# EAGLE design cardspoofer (EAGLE 6.3)
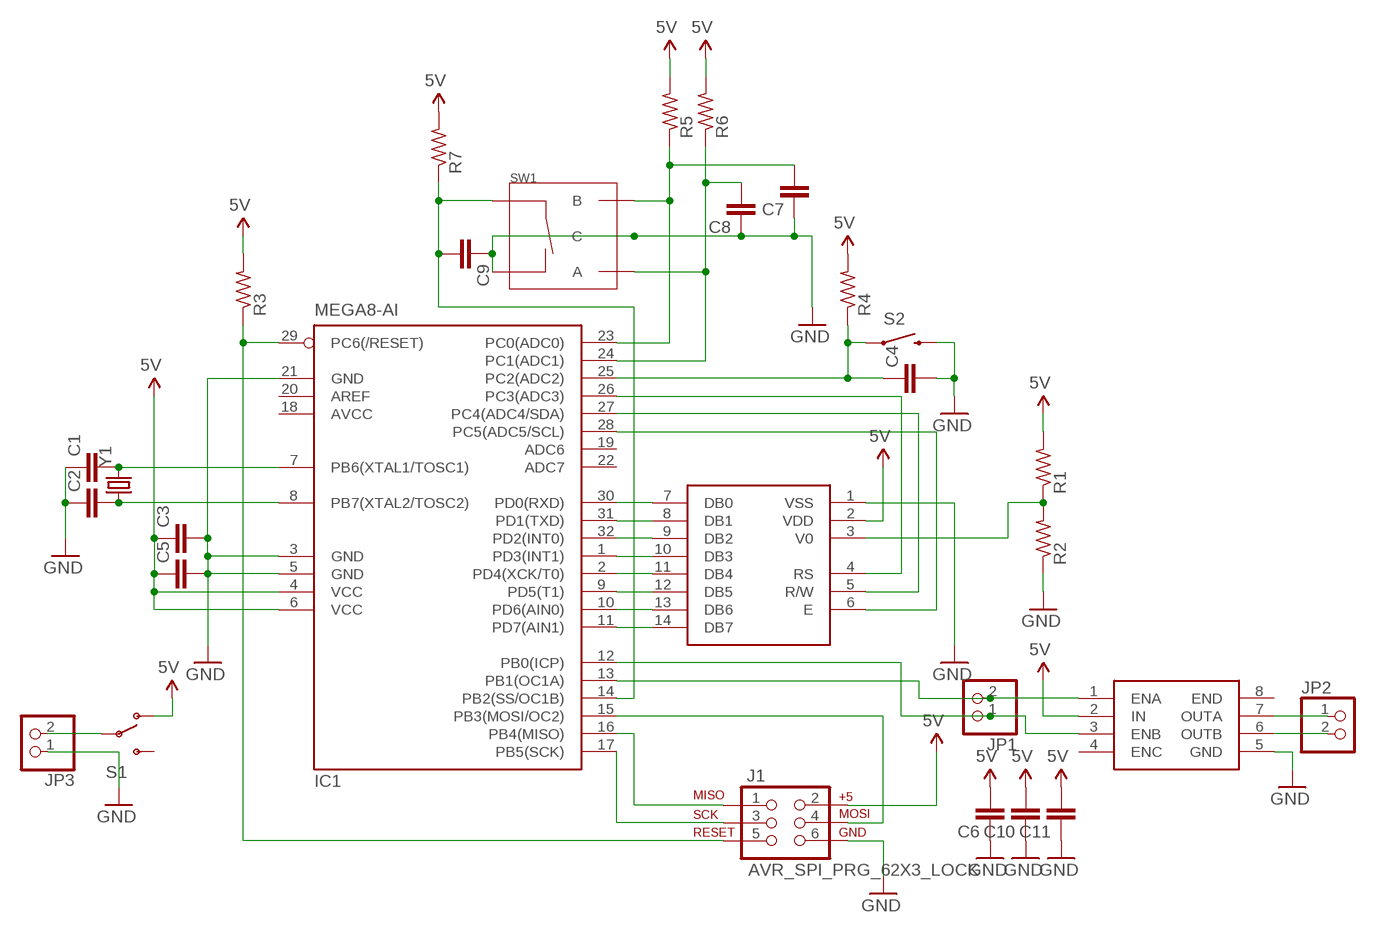
[diagram p0: schematic, sheet 1]

## Parts
C1  C-EUC0805K  [C0805K]
C2  C-EUC0805K  [C0805K]
C3  C-EUC0805K  [C0805K]
C4  C-EUC0805K  [C0805K]
C5  C-EUC0805K  [C0805K]
C6  C-EUC0805K  [C0805K]
C7  C-EUC0805K  [C0805K]
C8  C-EUC0805K  [C0805K]
C9  C-EUC0805K  [C0805K]
C10  C-EUC0805K  [C0805K]
C11  C-EUC0805K  [C0805K]
IC1  MEGA8-AI  [TQFP32-08]
J1  AVR_SPI_PRG_62X3_LOCK  [2X3_LOCK]
JP1  PINHD-1X2  [1X02]
JP2  PINHD-1X2  [1X02]
JP3  PINHD-1X2  [1X02]
R1  R-US_R0805  [R0805]
R2  R-US_R0805  [R0805]
R3  R-US_R0805  [R0805]
R4  R-US_R0805  [R0805]
R5  R-US_R0805  [R0805]
R6  R-US_R0805  [R0805]
R7  R-US_R0805  [R0805]
S1  SWITCH-SPDTSMD  [AYZ0202]
S2  SWITCH-MOMENTARY-2-SMD-1101NE  [TACTILE-SWITCH-1101NE]
SW1  ROTARTY_ENCODER  [ROTARY_ENC_PLAIN]
U$1  LCD  [NHD-0208AZ-RN-YBW-ND]
U$2  HBRIDGE  [H-BRIDGE]
Y1  CRYSTAL5X3  [CRYSTAL-SMD-5X3]

## Nets
5V: C3.1 C5.1 C6.2 C10.2 C11.2 IC1.4(VCC) IC1.6(VCC) J1.2 R1.2 R3.2 R4.2 R5.2 R6.2 R7.2 S1.1(O) U$1.2(VDD) U$2.2(IN)
GND: C1.1 C2.1 C3.2 C4.2 C5.2 C6.1 C7.1 C8.1 C9.1 C10.1 C11.1 IC1.3(GND) IC1.5(GND) IC1.21(GND) J1.6 JP3.1 R2.1 S2.2 SW1.C SW1.SW- U$1.1(VSS) U$2.5(GND)
N$1: R1.1 R2.2 U$1.3(V0)
N$2: IC1.30(PD0(RXD)) U$1.7(DB0)
N$3: IC1.31(PD1(TXD)) U$1.8(DB1)
N$4: IC1.32(PD2(INT0)) U$1.9(DB2)
N$5: IC1.1(PD3(INT1)) U$1.10(DB3)
N$6: IC1.2(PD4(XCK/T0)) U$1.11(DB4)
N$7: IC1.9(PD5(T1)) U$1.12(DB5)
N$8: IC1.10(PD6(AIN0)) U$1.13(DB6)
N$9: IC1.11(PD7(AIN1)) U$1.14(DB7)
N$10: IC1.26(PC3(ADC3)) U$1.4(RS)
N$11: IC1.27(PC4(ADC4/SDA)) U$1.5(R/W)
N$12: IC1.28(PC5(ADC5/SCL)) U$1.6(E)
N$13: IC1.29(PC6(/RESET)) J1.5 R3.1
N$14: IC1.17(PB5(SCK)) J1.3
N$15: IC1.16(PB4(MISO)) J1.1
N$16: IC1.15(PB3(MOSI/OC2)) J1.4
N$17: C1.2 IC1.7(PB6(XTAL1/TOSC1)) Y1.3
N$18: C2.2 IC1.8(PB7(XTAL2/TOSC2)) Y1.1
N$19: C4.1 IC1.25(PC2(ADC2)) R4.1 S2.1
N$20: IC1.13(PB1(OC1A)) JP1.2 U$2.1(ENA)
N$21: IC1.12(PB0(ICP)) JP1.1 U$2.3(ENB)
N$22: JP2.1 U$2.7(OUTA)
N$23: JP2.2 U$2.6(OUTB)
N$24: C7.2 IC1.23(PC0(ADC0)) R5.1 SW1.B
N$25: C8.2 IC1.24(PC1(ADC1)) R6.1 SW1.A
N$26: C9.2 IC1.14(PB2(SS/OC1B)) R7.1 SW1.SW+
N$27: JP3.2 S1.2(P)
Unconnected: IC1.19(ADC6) IC1.20(AREF) IC1.22(ADC7) S1.3(S) U$2.4(ENC) U$2.8(END)

## Power pins joined to a net without a drawn wire
AVCC: IC1.18(AVCC)

## Library data of the parts
C1-C11 = resistor:C-EU: CAPACITOR, European symbol
IC1 = atmel:MEGA8: MICROCONTROLLER 8 Kbytes FLASH, 1 kbytes SRAM, 512 bytes EEPROM, USART, 6-channel 10 bit ADC, 2-channel 8 bit ADC Pin compatible with Atmega48, ATMega88, ATMega168 Source: avr.lbr; MPN: ATMEGA8-16AU; OC_FARNELL: 9171371; OC_NEWARK: 73M8863
J1 = SparkFun-Connectors:AVR_SPI_PRG_6: AVR ISP 6 Pin This is the reduced ISP connector for AVR programming. Common on Arduino. This footprint will take up less PCB space and can be used with a 10-pin to 6-pin adapter such as SKU: BOB-08508 **Special note about "TEST_POINT" package. The stop mask is on the top side, so if you want your programming test points to be on the bottom of your board, make sure to place this package on the bottom side of the board. This also ensure that the orientation to program from the bottom side will be correct.
JP1-JP3 = pinhead:PINHD-1X2: PIN HEADER
R1-R7 = rcl:R-US_: RESISTOR, American symbol
S1 = SparkFun-Electromechanical:SWITCH-SPDT: SPDT Switch Simple slide switch, Spark Fun Electronics SKU : COM-00102 DPDT SMT slide switch, AYZ0202, SWCH-08179; PROD_ID: SWCH-08179
S2 = SparkFun-Electromechanical:SWITCH-MOMENTARY-2: Various NO switches- pushbuttons, reed, etc
SW1 = SparkFun-Electromechanical:ROTARTY_ENCODER: Simple no LED rotary encoder Example: COM-09117
U$1 = lcd:LCD
U$2 = hbridgedriver:HBRIDGE: AAT4901
Y1 = SparkFun-FreqCtrl:CRYSTAL: Various standard crystals. Proven footprints. Spark Fun Electronics SKU : COM-00534

## Board
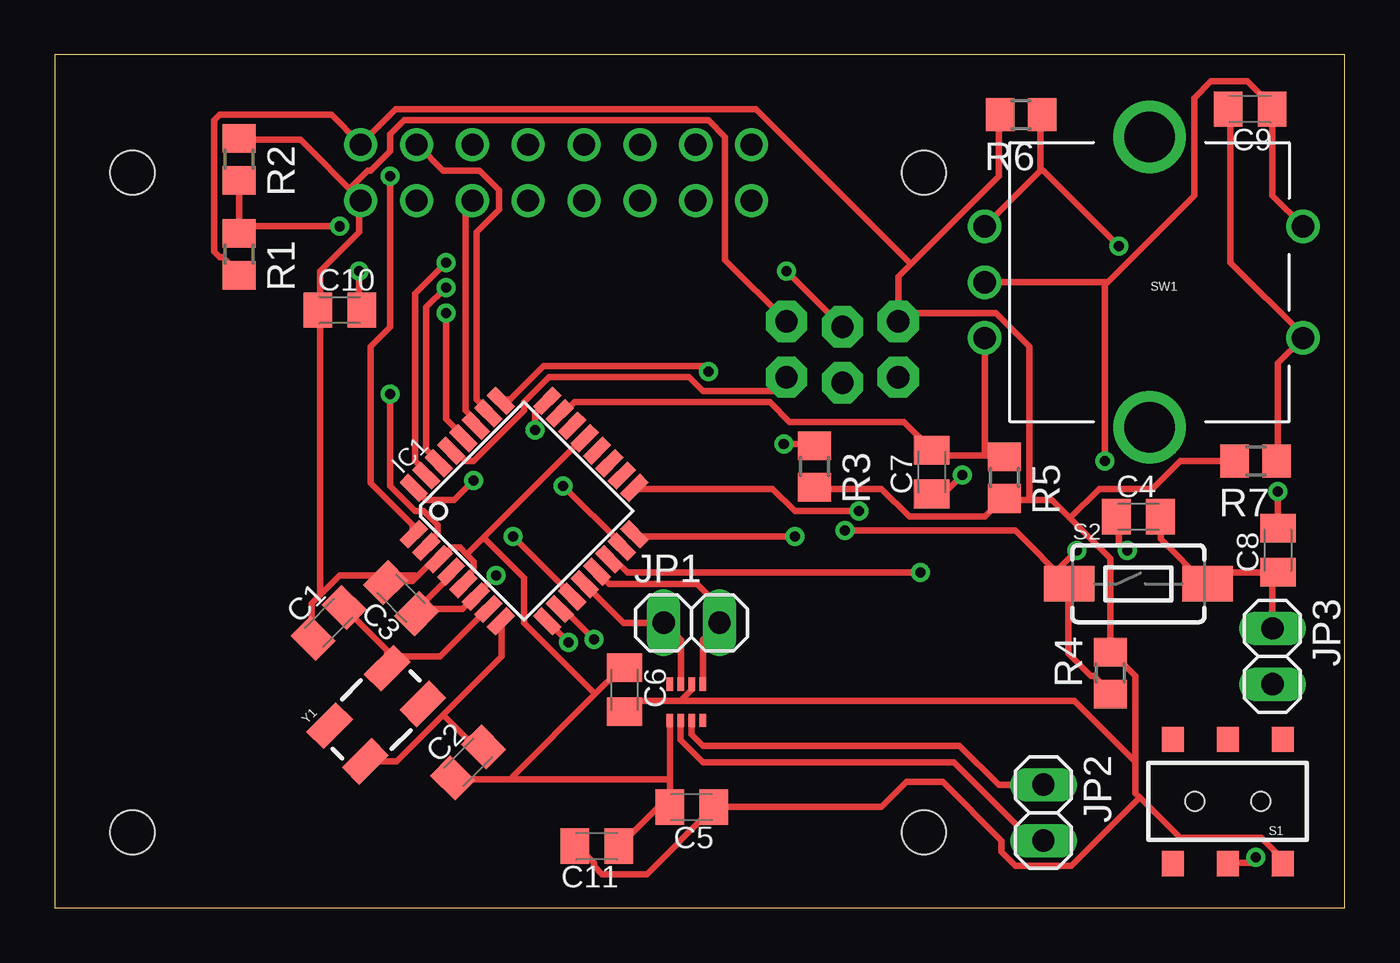
[diagram p1: board, top side]
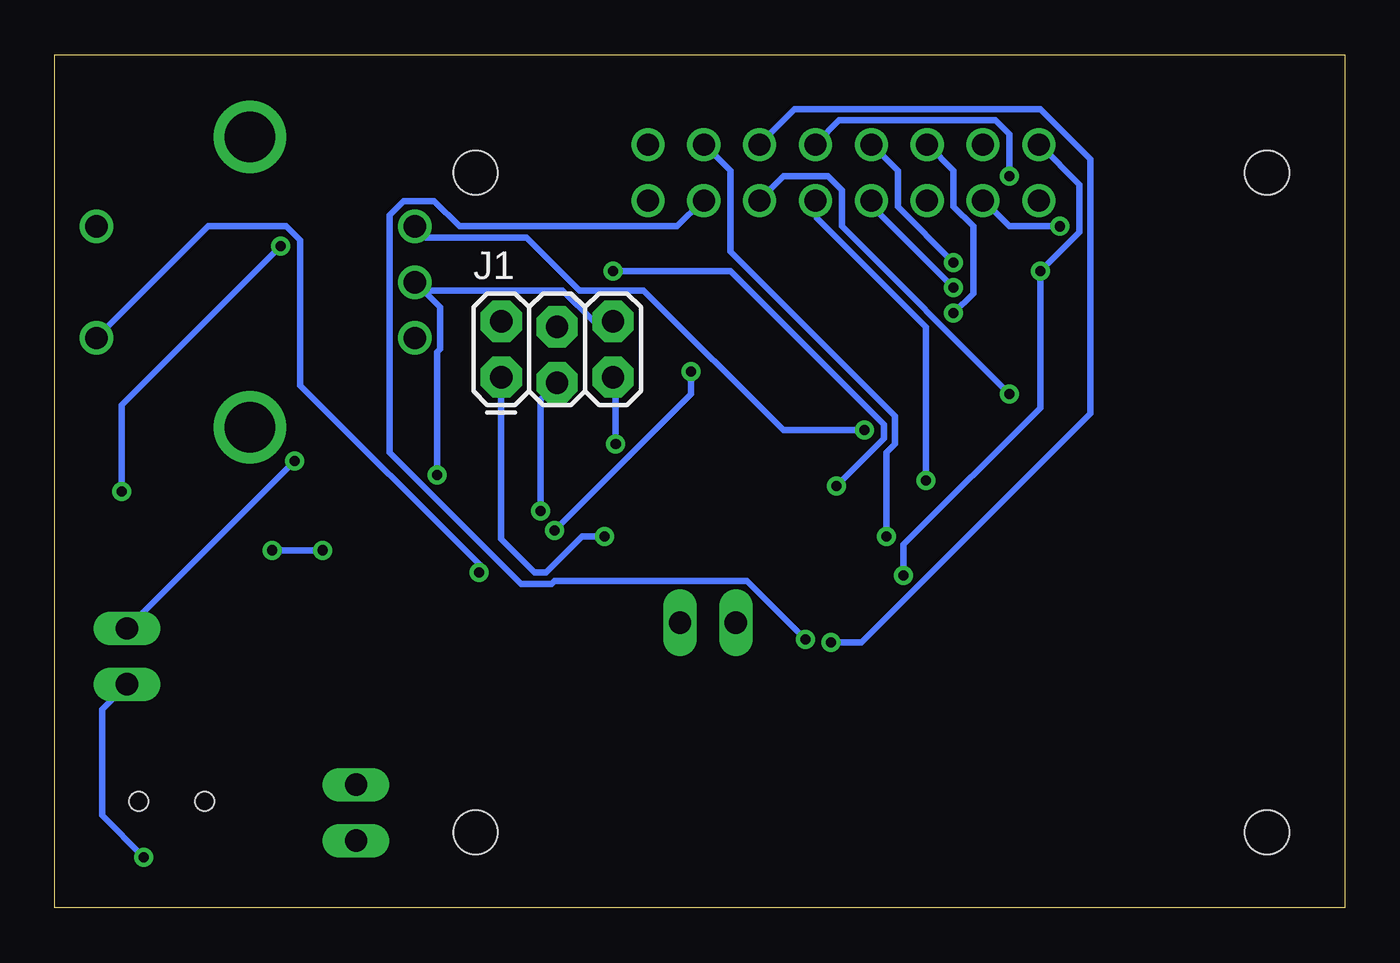
[diagram p2: board, bottom side, seen from below]

Size 58.65 x 38.79 mm. Coordinates in mm from the lower left corner, seen from the top.
Outline: 0,0 58.65,0 58.65,38.79 0,38.79 0,0
Copper layers (1*16): Top 0.035mm / dielectric 1.5mm / Bottom 0.035mm
Design rules "default *": minimum track width 12mil, minimum drill 18mil, track to track 8mil, track to pad 8mil, pad to pad 8mil, via to via 8mil, smd to smd 8mil, copper to edge 40mil, drill to drill 8mil, minimum pad ring 10mil, minimum via ring 8mil, stop-mask expansion 4mil, vias tented up to drill 0mil, thermal gap 10mil

### Footprints (pad centres in the part's own frame; a part is rotated, then mirrored left to right if it is on the bottom)
C0805K = smd 1.3 x 1.6: 1 -1,0; 2 1,0
TQFP32-08 = smd 1.27 x 0.559: 1 -4.293,2.8; 2 -4.293,2; 3 -4.293,1.2; 4 -4.293,0.4; 5 -4.293,-0.4; 6 -4.293,-1.2; 7 -4.293,-2; 8 -4.293,-2.8; 17 4.293,-2.8; 18 4.293,-2; 19 4.293,-1.2; 20 4.293,-0.4; 21 4.293,0.4; 22 4.293,1.2; 23 4.293,2; 24 4.293,2.8 | smd 0.559 x 1.27: 9 -2.8,-4.293; 10 -2,-4.293; 11 -1.2,-4.293; 12 -0.4,-4.293; 13 0.4,-4.293; 14 1.2,-4.293; 15 2,-4.293; 16 2.8,-4.293; 25 2.8,4.293; 26 2,4.293; 27 1.2,4.293; 28 0.4,4.293; 29 -0.4,4.293; 30 -1.2,4.293; 31 -2,4.293; 32 -2.8,4.293
2X3_LOCK = drill 1.016 pad 1.88 octagon: 1 0,0; 2 0,2.54; 3 2.54,-0.254; 4 2.54,2.286; 5 5.08,0; 6 5.08,2.54
1X02 = drill 1.016 long: 1 -1.27,0; 2 1.27,0
R0805 = smd 1.3 x 1.5: 1 -0.95,0; 2 0.95,0
AYZ0202 = smd 1 x 1.15: 1 -2.5,2.825; 2 0,2.825; 3 2.5,2.825; 4 -2.5,-2.825; 5 0,-2.825; 6 2.5,-2.825 | hole 0.85: 1.5,0; -1.5,0
TACTILE-SWITCH-1101NE = smd 2.3 x 1.6: 1 -3.15,0; 2 3.15,0
ROTARY_ENC_PLAIN = drill 1.016: A 7.493,-2.54; B 7.493,2.54; C 7.493,0; SW+ -6.985,2.54; SW- -6.985,-2.54 | drill 2.286: P$3 0,6.604; P$4 0,-6.604
NHD-0208AZ-RN-YBW-ND = drill 1: 1 12.38,-4.67; 2 12.38,-2.13; 3 14.92,-4.67; 4 14.92,-2.13; 5 17.46,-4.67; 6 17.46,-2.13; 7 20,-4.67; 8 20,-2.13; 9 22.54,-4.67; 10 22.54,-2.13; 11 25.08,-4.67; 12 25.08,-2.13; 13 27.62,-4.67; 14 27.62,-2.13; 15 30.16,-4.67; 16 30.16,-2.13 | hole 2: 2,-3.4; 38,-3.4; 2,-33.4; 38,-33.4
H-BRIDGE = smd 0.6 x 0.3: 1 0,0; 2 0,-0.5; 3 0,-1; 4 0,-1.5; 5 1.65,-1.5; 6 1.65,-1; 7 1.65,-0.5; 8 1.65,0
CRYSTAL-SMD-5X3 = smd 1.9 x 1.1: 1 -1.85,-1.15; 2 1.85,-1.15; 3 1.85,1.15; 4 -1.85,1.15

### Placement (x,y rotation side)
C1  12.45,12.95 45 top
C2  18.8,6.6 45 top
C3  15.75,14.08 135 top
C4  49.28,17.78 0 top
C5  28.96,4.57 180 top
C6  25.91,9.91 270 top
C7  39.88,19.81 90 top
C8  55.63,16.26 90 top
C9  54.36,36.32 180 top
C10  12.95,27.18 0 top
C11  24.64,2.79 180 top
IC1  21.34,18.03 45 top
J1  38.35,24.13 0 bottom
JP1  28.96,12.95 0 top
JP2  44.96,4.32 270 top
JP3  55.37,11.43 270 top
R1  8.38,29.72 270 top
R2  8.38,34.04 270 top
R3  34.54,20.07 270 top
R4  48.01,10.67 90 top
R5  43.18,19.56 270 top
R6  43.94,36.07 180 top
R7  54.61,20.32 180 top
S1  53.34,4.83 180 top
S2  49.28,14.73 0 top
SW1  49.78,28.45 180 top
U$1  1.52,36.83 0 top
U$2  29.46,10.16 270 top
Y1  14.61,8.77 45 top

### Tracks (layer width: path | path; a pad name or v marks a point on that pad's centre or on a via)
5V  (via drill 0.46)
  Top 0.305: U$2.2 28.96,9.91 28.45,9.4 | 28.45,9.4 26.4,9.4 C6.2 | IC1.4 17.91,15.24 17.91,14.99 16.38,13.46 C3.1 16.64,13.59 18.54,13.59 19.05,14.1 IC1.6 19.18,14.22 v20.07,15.11 | R1.2 8.38,28.83 7.62,29.59 7.49,29.59 7.24,29.84 7.24,35.81 7.49,36.07 12.57,36.07 13.84,34.8 U$1.2 13.97,34.8 15.49,36.32 31.88,36.32 38.93,29.27 | v13.84,28.96 13.84,27.18 C10.2 | 38.93,29.27 38.35,28.7 J1.2 38.48,27.05 42.8,27.05 44.32,25.53 44.32,18.54 | 38.93,29.27 42.93,33.27 42.93,36.07 R6.2 | C11.2 23.75,2.79 24.51,2.03 24.51,1.91 24.89,1.52 26.92,1.52 29.97,4.57 C5.1 37.59,4.57 38.73,5.71 40.39,5.71 43.05,3.05 43.05,2.54 43.69,1.91 46.23,1.91 49.34,5.02 | 49.34,5.02 49.15,5.21 49.15,6.73 | 49.34,5.02 51.18,3.17 54.86,3.17 55.75,2.29 55.75,2.03 S1.1 | 49.15,6.73 49.15,10.54 48.01,11.68 R4.2 48.01,15.88 46.16,17.72 | 44.32,18.54 45.34,18.54 46.16,17.72 | 44.32,18.54 43.18,18.54 R5.2 43.05,18.54 42.29,17.78 38.86,17.78 37.59,19.05 34.54,19.05 R3.2 | R7.2 51.18,20.32 49.91,19.05 47.5,19.05 46.16,17.72 | 28.45,9.4 46.35,9.4 49.02,6.73 49.15,6.73
  Bottom 0.305: U$1.2 13.84,34.67 12.06,32.89 12.06,30.73 v13.84,28.96 13.84,22.73 20.07,16.51 v20.07,15.11
GND  (via drill 0.46)
  Top 0.305: U$2.5 27.96,5.84 | 27.96,5.84 C5.2 27.81,4.95 25.65,2.79 C11.1 | 27.96,5.84 20.83,5.84 | 20.83,5.84 18.16,5.84 C2.1 | 24.57,9.72 20.83,5.97 20.83,5.84 | 24.57,9.72 25.65,10.79 25.91,10.79 C6.1 | R2.1 8.38,34.92 11.18,34.92 13.84,32.26 U$1.1 | U$1.1 13.84,32.13 13.84,30.73 12.06,28.96 12.06,27.18 C10.1 12.06,27.05 12.06,14.35 12.13,14.29 | 16.45,15.05 16.26,14.86 15.11,14.86 C3.2 | 16.45,15.05 17.14,15.75 17.4,15.75 IC1.3 17.53,15.88 18.03,16.38 18.42,16.38 18.73,16.07 | 18.73,16.07 19.05,15.75 19.05,15.37 18.67,14.99 18.67,14.73 IC1.5 | 18.73,16.07 19.5,16.83 | 19.5,16.83 24,21.34 IC1.21 | 12.13,14.29 12.95,15.11 16.38,15.11 16.45,15.05 | 12.13,14.29 11.68,13.84 11.68,12.32 C1.1 | 24.57,9.72 21.34,12.95 21.34,14.99 19.5,16.83 | C4.2 50.29,17.78 50.29,16.76 52.32,14.73 S2.2 51.94,15.24 55.63,15.24 C8.1 55.37,15.11 JP3.1 | SW1.SW- 55.37,32.38 55.37,36.32 C9.1 55.37,36.45 54.23,37.59 52.58,37.59 51.82,36.83 51.82,32.38 47.88,28.45 47.75,28.45 | v41.27,19.68 40.51,18.92 39.88,18.92 C7.1 | SW1.C 47.75,28.45 | 47.75,28.45 v47.75,20.32 | J1.6 30.48,29.46 30.48,35.05 29.72,35.81 15.88,35.81 15.24,35.18 15.24,34.42 14.35,33.53 14.22,33.53 13.46,32.77 U$1.1
  Bottom 0.305: v41.27,19.68 41.27,25.27 41.15,25.4 41.15,27.3 SW1.C 41.78,28.07 35.56,28.07 34.16,26.67 J1.6 | v47.75,20.32 JP3.1
N$1  (via drill 0.46)
  Top 0.305: R2.2 R1.1 8.51,30.99 v12.95,30.99
  Bottom 0.305: v12.95,30.99 15.24,30.99 16.38,32.13 U$1.3
N$2  (via drill 0.46)
  Top 0.305: v17.78,28.19 16.89,27.3 16.89,20.83 17.4,20.32 IC1.30
  Bottom 0.305: v17.78,28.19 21.46,31.88 21.46,32.13 U$1.7
N$3  (via drill 0.46)
  Top 0.305: v17.78,29.34 16.38,27.94 16.38,20.32 16.76,19.94 16.76,19.68 IC1.31
  Bottom 0.305: v17.78,29.34 20.32,31.88 20.32,33.53 21.46,34.67 U$1.8
N$4  (via drill 0.46)
  Top 0.305: v19.05,19.43 18.16,18.54 16.89,18.54 16.38,19.05 IC1.32
  Bottom 0.305: v19.05,19.43 19.05,26.42 24,31.37 24,32.13 U$1.9
N$5  (via drill 0.46)
  Top 0.305: v15.24,33.27 15.24,26.42 14.35,25.53 14.35,19.3 16.26,17.4 16.26,17.02 IC1.1
  Bottom 0.305: v15.24,33.27 15.24,35.18 15.88,35.81 22.99,35.81 24,34.8 U$1.10
N$6  (via drill 0.46)
  Top 0.305: v15.24,23.37 15.24,19.18 16.38,18.03 16.76,18.03 17.4,17.4 17.4,17.02 16.89,16.51 IC1.2
  Bottom 0.305: v15.24,23.37 22.86,30.99 22.86,32.64 23.5,33.27 25.53,33.27 26.54,32.26 U$1.11
N$7  (via drill 0.46)
  Top 0.305: v23.37,12.06 22.48,12.95 IC1.9
  Bottom 0.305: v23.37,12.06 21.97,12.06 11.56,22.48 11.56,34.04 13.84,36.32 25.02,36.32 26.54,34.8 U$1.12
N$8  (via drill 0.46)
  Top 0.305: v24.51,12.19 23.24,13.46 22.99,13.46 IC1.10
  Bottom 0.305: v24.51,12.19 27.18,14.86 35.94,14.86 36.07,14.73 37.46,14.73 43.43,20.7 43.43,31.5 42.8,32.13 41.4,32.13 40.26,30.99 30.35,30.99 29.21,32.13 U$1.13
N$9  (via drill 0.46)
  Top 0.305: v20.83,16.89 23.5,14.22 IC1.11
  Bottom 0.305: v20.83,16.89 20.83,20.7 20.45,21.08 20.45,22.35 27.94,29.84 27.94,33.53 29.08,34.67 U$1.14
N$10
  Top 0.305: IC1.26 19.69,22.61 19.18,23.11 19.18,30.73 20.19,31.75 20.19,32.64 19.3,33.53 17.65,33.53 16.51,34.67 U$1.4
N$11
  Top 0.305: IC1.27 19.05,21.97 19.05,22.23 18.67,22.61 18.67,31.88 18.92,32.13 U$1.5
N$12  (via drill 0.46)
  Top 0.305: v17.78,27.05 17.78,22.23 18.54,21.46 IC1.28
  Bottom 0.305: v17.78,27.05 16.89,27.94 16.89,30.99 17.78,31.88 17.78,33.53 18.92,34.67 U$1.6
N$13  (via drill 0.46)
  Top 0.305: J1.5 32.64,23.5 29.46,23.5 28.83,24.13 22.48,24.13 21.34,22.99 21.34,22.61 19.05,20.32 18.67,20.32 18.29,20.7 18.03,20.7 IC1.29 | v33.15,21.08 34.54,21.08 R3.1
  Bottom 0.305: v33.15,21.08 33.15,24 J1.5
N$14  (via drill 0.46)
  Top 0.305: v36.58,18.03 33.66,18.03 32.64,19.05 26.42,19.05 IC1.17
  Bottom 0.305: v36.58,18.03 36.58,23.11 J1.3
N$15  (via drill 0.46)
  Top 0.305: v33.66,16.89 26.42,16.89 IC1.16
  Bottom 0.305: v33.66,16.89 34.67,16.89 36.32,15.24 36.83,15.24 38.35,16.76 J1.1
N$16  (via drill 0.46)
  Top 0.305: v23.11,19.18 25.78,16.51 IC1.15 | J1.4 v33.27,28.96
  Bottom 0.305: v23.11,19.18 20.96,21.34 20.96,21.97 27.94,28.96 v33.27,28.96
N$17
  Top 0.305: IC1.7 19.68,13.58 17.53,11.43 15.65,11.43 Y1.3 15.11,11.71 C1.2
N$18
  Top 0.305: Y1.1 15.54,6.65 17.65,8.76 | 17.65,8.76 20.32,11.43 20.32,12.98 IC1.8 | C2.2 19.11,7.31 17.65,8.76
N$19  (via drill 0.46)
  Top 0.305: v29.72,24.38 29.46,24.64 22.23,24.64 20.7,23.11 20.32,23.11 IC1.25 | v35.94,17.14 43.69,17.14 46.1,14.73 S2.1 | R4.1 48.01,9.78 47.24,10.54 47.12,10.54 46.1,11.56 46.1,14.61 S2.1 | v48.77,16.26 48.39,16.64 48.39,17.78 C4.1 | v46.48,16.26 45.59,15.37 S2.1
  Bottom 0.305: v29.72,24.38 29.72,23.37 v35.94,17.14 | v46.48,16.26 v48.77,16.26
N$20
  Top 0.305: IC1.13 25.2,14.73 29.21,14.73 30.23,13.72 JP1.2 29.46,12.19 U$2.1
N$21
  Top 0.305: IC1.12 25.85,12.95 JP1.1 28.46,12.18 U$2.3
N$22
  Top 0.305: JP2.1 42.93,5.59 41.15,7.37 29.46,7.37 28.96,7.87 U$2.7
N$23
  Top 0.305: JP2.2 44.45,3.05 40.89,6.6 29.46,6.6 28.45,7.62 28.45,8.49 U$2.6
N$24
  Top 0.305: IC1.23 22.99,22.61 23.24,22.61 23.62,22.99 32.51,22.99 33.4,22.1 38.61,22.1 39.88,20.83 C7.2 40,20.83 40.26,20.57 42.29,20.57 | 42.29,20.57 43.18,20.57 R5.1 | 42.29,20.57 SW1.B
N$25  (via drill 0.46)
  Top 0.305: v21.84,21.72 21.84,22.48 22.35,22.99 IC1.24 | 44.83,33.53 44.83,36.07 R6.1 | SW1.A 44.83,33.53 | v55.63,18.92 C8.2 | v48.39,30.1 44.96,33.53 44.83,33.53
  Bottom 0.305: v21.84,21.72 25.53,21.72 31.88,28.07 34.8,28.07 37.21,30.48 41.78,30.48 SW1.A | v55.63,18.92 55.63,22.86 v48.39,30.1
N$26  (via drill 0.46)
  Top 0.305: v39.37,15.24 26.04,15.24 25.53,15.75 25.27,15.75 IC1.14 | R7.1 55.63,20.32 55.63,24.77 SW1.SW+ 56.77,26.04 53.47,29.34 53.47,36.32 C9.2
  Bottom 0.305: v39.37,15.24 39.37,15.62 47.5,23.75 47.5,30.35 48.13,30.99 51.69,30.99 SW1.SW+
N$27  (via drill 0.46)
  Top 0.305: v54.61,2.29 54.36,2.03 53.34,2.03 S1.2
  Bottom 0.305: v54.61,2.29 56.52,4.19 56.52,9.02 JP3.2